# EAGLE design slang-lsm6dsl-palec (EAGLE 9.4.2)
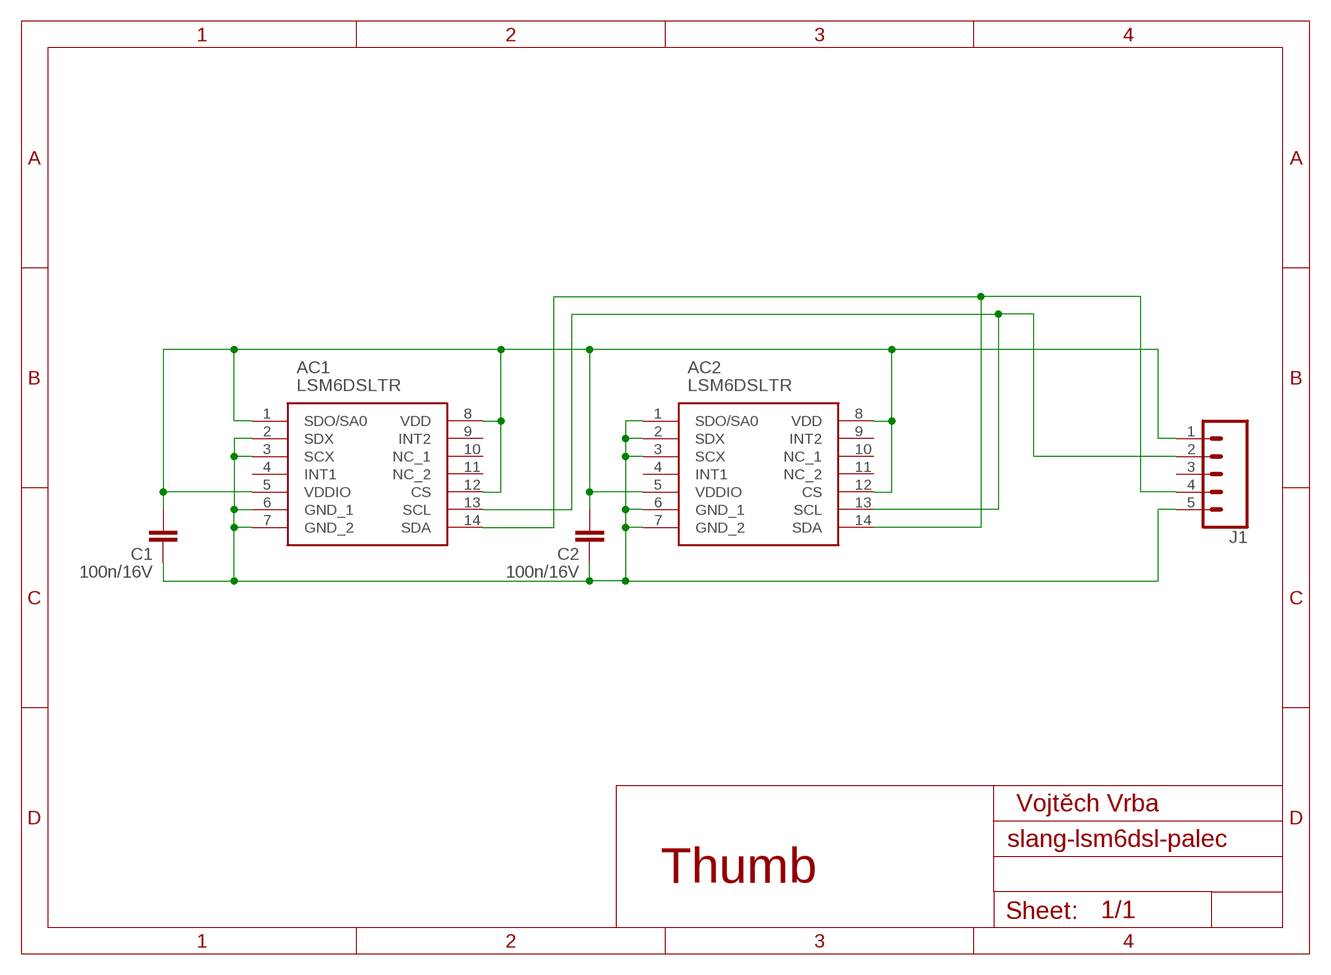
[diagram p0: schematic, sheet 1]

## Parts
AC1  LSM6DSLTR  [LGA-14(2.5X3X0.86)]
AC2  LSM6DSLTR  [LGA-14(2.5X3X0.86)]
C1  100n/16V  C-EUC0603  [C0603]
C2  100n/16V  C-EUC0603  [C0603]
J1  CONN_051.27MM  [1X05_1.27MM]

## Nets
GND: AC1.2(SDX) AC1.3(SCX) AC1.6(GND_1) AC1.7(GND_2) AC2.1(SDO/SA0) AC2.2(SDX) AC2.3(SCX) AC2.6(GND_1) AC2.7(GND_2) C1.1 C2.1 J1.5
SCL: AC1.13(SCL) AC2.13(SCL) J1.2
SDA: AC1.14(SDA) AC2.14(SDA) J1.4
VDD: AC1.1(SDO/SA0) AC1.5(VDDIO) AC1.8(VDD) AC1.12(CS) AC2.5(VDDIO) AC2.8(VDD) AC2.12(CS) C1.2 C2.2 J1.1
Unconnected: AC1.4(INT1) AC1.9(INT2) AC1.10(NC_1) AC1.11(NC_2) AC2.4(INT1) AC2.9(INT2) AC2.10(NC_1) AC2.11(NC_2) J1.3

## Notes on the sheet
- Vojtěch Vrba
- Thumb

## Library data of the parts
AC1 AC2 = LSM6DSLTR:LSM6DSLTR: IMUs - Inertial Measurement Units iNEMO inertial module: 3D accelerometer and 3D gyroscope Source: Datasheet <http://www.st.com/content/ccc/resource/technical/document/datasheet/ee/23/a0/dc/1d/68/45/52/DM00237456.pdf/files/DM00237456.pdf/jcr:content/translations/en.DM00237456.pdf>; ARROW_PART_NUMBER: LSM6DSLTR; ARROW_PRICE-STOCK: https://www.arrow.com/en/products/lsm6dsltr/stmicroelectronics; DESCRIPTION: IMUs - Inertial Measurement Units iNEMO inertial module: 3D accelerometer and 3D gyroscope; HEIGHT: mm; MANUFACTURER_NAME: STMicroelectronics; MANUFACTURER_PART_NUMBER: LSM6DSLTR; RS_PART_NUMBER: 1639811P; RS_PRICE-STOCK: http://uk.rs-online.com/web/p/products/1639811P
C1 C2 = resistor:C-EU: CAPACITOR, European symbol
J1 = SparkFun-Connectors:CONN_05: Multi connection point. Often used as Generic Header-pin footprint for 0.1 inch spaced/style header connections On any of the 0.1 inch spaced packages, you can populate with these: Break Away Headers - Straight <https://www.sparkfun.com/products/116> (PRT-00116) Break Away Male Headers - Right Angle <https://www.sparkfun.com/products/553> (PRT-00553) Female Headers <https://www.sparkfun.com/products/115> (PRT-00115) Break Away Headers - Machine Pin <https://www.sparkfun.com/products/117> (PRT-00117) Break Away Female Headers - Swiss Machine Pin <https://www.sparkfun.com/products/743> (PRT-00743) For SCREWTERMINALS and SPRING TERMINALS visit here: Screw Terimnals on SparkFun.com <https://www.sparkfun.com/search/results?term=Screw+Terminals> (5mm/3.5mm/2.54mm spacing) This device is also useful as a general connection point to wire up your design to another part of your project. Our various solder wires solder well into these plated through hole pads. Hook-Up Wire - Assortment (Stranded, 22 AWG) <https://www.sparkfun.com/products/11375> (PRT-11375) Hook-Up Wire - Assortment (Solid Core, 22 AWG) <https://www.sparkfun.com/products/11367> (PRT-11367) View the entire wire category on our website here <https://www.sparkfun.com/categories/141> Special notes: Molex polarized connector foot print use with SKU : PRT-08231 with associated crimp pins and housings. 1MM SMD Version SKU: PRT-10208

## Board
Positions: 76 mm, 45 mm
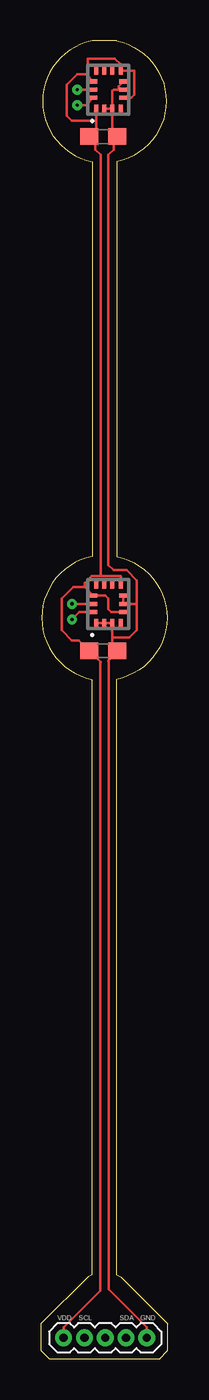
[diagram p1: board, top side]
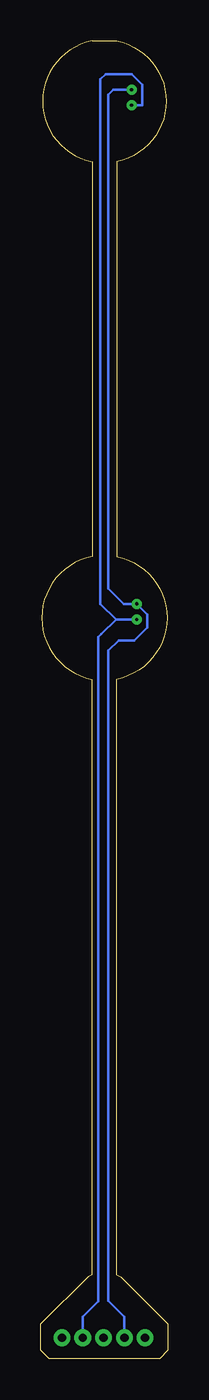
[diagram p2: board, bottom side, seen from below]

Size 7.75 x 80.5 mm. Coordinates in mm from the lower left corner, seen from the top.
Outline: 7.25,0 0.5,0 0,0.5 0,2.12 2.88,5 3.12,5.12 3.12,41.5 arc-157 3.12,49 3.12,73.12 arc-157 3.12,80.5 4.62,80.5 arc-157 4.62,73.12 4.62,49 arc-157 4.62,41.5 4.62,5.12 4.88,5 7.75,2.12 7.75,0.5 7.25,0
Outline: 7.25,0 7.28,0
Copper layers (1*16): Top 0.035mm / dielectric 1.5mm / Bottom 0.035mm
Design rules "default *": minimum track width 6mil, minimum drill 0.35mm, track to track 6mil, track to pad 6mil, pad to pad 6mil, via to via 6mil, smd to smd 3mil, copper to edge 6mil, drill to drill 6mil, minimum pad ring 10mil, minimum via ring 8mil, stop-mask expansion 4mil, vias tented up to drill 0mil, thermal gap 10mil

### Footprints (pad centres in the part's own frame; a part is rotated, then mirrored left to right if it is on the bottom)
LGA-14(2.5X3X0.86) = smd 0.475 x 0.25: 1 -1.163,0.75; 2 -1.163,0.25; 3 -1.163,-0.25; 4 -1.163,-0.75; 8 1.163,-0.75; 9 1.163,-0.25; 10 1.163,0.25; 11 1.163,0.75 | smd 0.25 x 0.475: 5 -0.5,-0.912; 6 0,-0.912; 7 0.5,-0.912; 12 0.5,0.912; 13 0,0.912; 14 -0.5,0.912
C0603 = smd 1.1 x 1: 1 -0.85,0; 2 0.85,0
1X05_1.27MM = drill 0.508 pad 1: 1 0,0; 2 1.27,0; 3 2.54,0; 4 3.81,0; 5 5.08,0

### Placement (x,y rotation side)
AC1  4.12,77.52 90 top
AC2  4.12,46.1 90 top
C1  3.8,74.66 180 top
C2  3.8,43.25 180 top
J1  1.39,1.27 0 top

### Tracks (layer width: path | path; a pad name or v marks a point on that pad's centre or on a via)
GND
  Top 0.152: AC1.2 AC1.3 | AC1.3 4.37,74.94 C1.1 4.65,74.4 4.44,74.19 4.44,73.87 4.12,73.55 4.12,48.49 4.44,48.17 5.23,48.17 5.86,47.53 5.86,46.1 | AC1.3 4.37,77.45 4.44,77.52 4.75,77.52 | 4.75,77.52 AC1.6 | AC1.7 4.75,77.74 4.75,77.52 | AC2.1 AC2.2 AC2.3 4.37,44.04 | 4.37,44.04 4.37,43.53 C2.1 4.65,43.15 4.15,42.64 | AC2.7 AC2.6 5.86,46.1 | 5.86,46.1 5.86,44.52 5.39,44.04 4.37,44.04 | 4.15,42.64 4.12,42.61 | J1.5 6.46,1.91 4.15,4.22 4.15,42.64
SCL  (via drill 0.2)
  Top 0.152: AC1.13 v2.21,77.52 | AC2.13 v1.9,46.1
  Bottom 0.152: v2.21,77.52 3.32,77.52 3.64,77.2 3.64,47.06 2.69,46.1 v1.9,46.1 1.26,45.47 1.26,44.68 2.05,43.88 3.01,43.88 3.64,43.25 3.64,3.53 2.66,2.54 J1.2
SDA  (via drill 0.2)
  Top 0.152: AC1.14 2.75,76.57 v2.21,76.57 | AC2.14 2.35,45.6 v1.9,45.15
  Bottom 0.152: v2.21,76.57 1.58,76.57 1.58,77.84 2.21,78.47 3.8,78.47 4.12,78.16 4.12,46.1 3.17,45.15 | 3.17,45.15 v1.9,45.15 | 3.17,45.15 4.05,44.26 4.24,44.08 4.24,3.49 5.2,2.54 J1.4
VDD
  Top 0.152: AC1.1 3.37,75.61 | 3.37,75.61 3.37,75.08 C1.2 3.32,74.29 3.32,73.87 3.64,73.55 3.64,47.79 | AC1.5 5.52,77.02 5.71,77.2 5.71,78.69 AC1.8 4.87,79.07 4.51,79.42 2.85,79.42 2.85,78.47 | 2.85,78.47 2.85,78.38 AC1.12 | 2.85,78.47 2.21,78.47 1.58,77.84 1.58,75.93 1.9,75.61 3.37,75.61 | AC2.5 4.3,45.6 4.12,45.79 4.12,46.42 3.94,46.6 AC2.12 2.69,47.12 | AC2.8 4.87,47.79 3.64,47.79 | 3.64,47.79 3.11,47.79 2.69,47.38 2.69,47.12 | 2.69,47.12 1.96,47.12 1.26,46.42 1.26,44.52 1.9,43.88 2.31,43.88 C2.2 3.64,42.56 3.61,42.52 3.61,4.13 1.39,1.91 J1.1

### Text on the board
tNames: VDD | SCL | SDA | GND